# EAGLE design Extender (EAGLE 5.04)
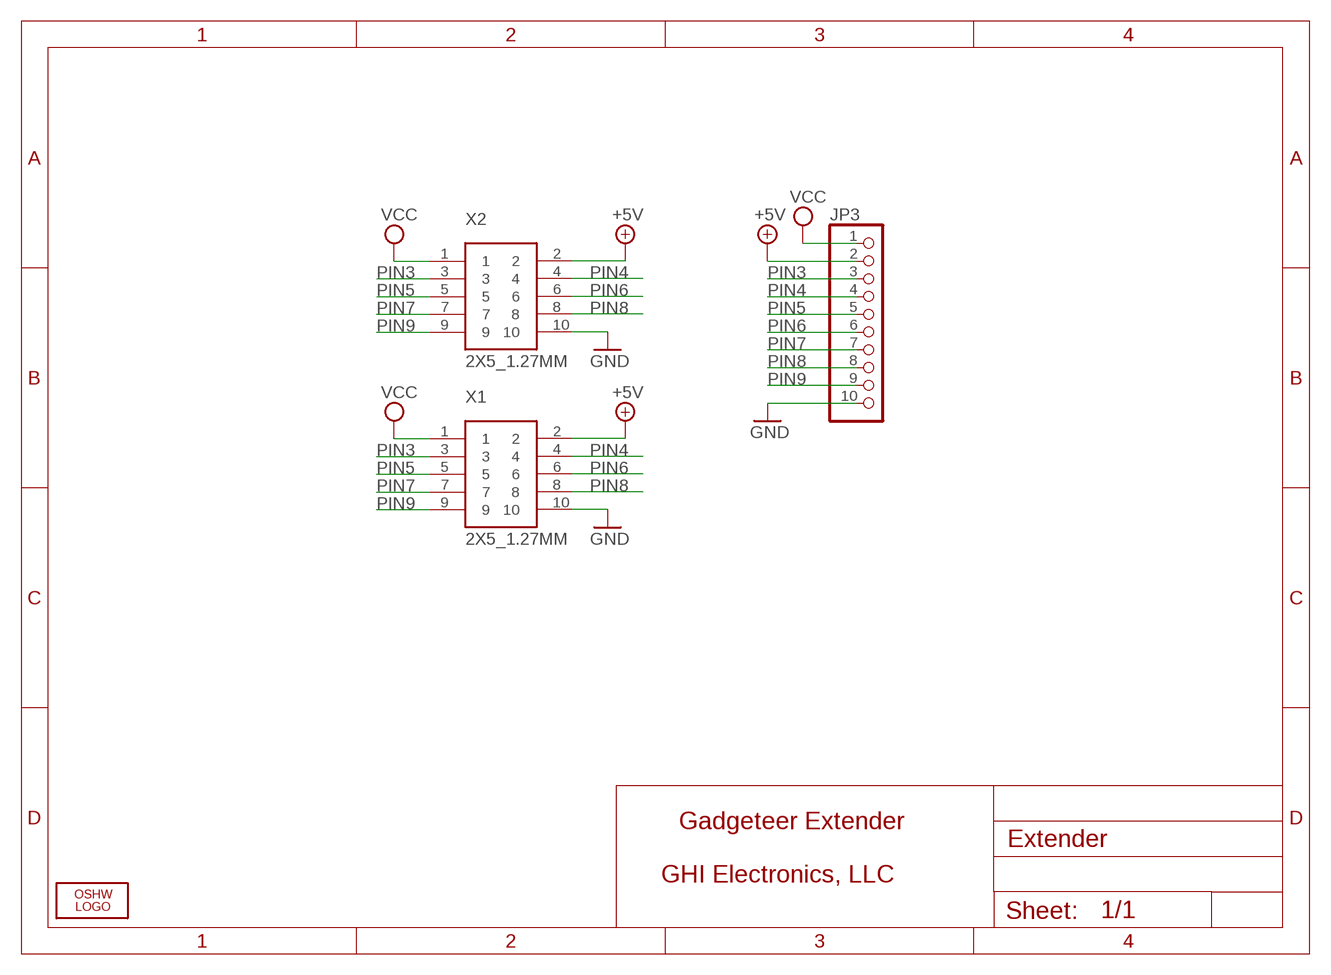
[diagram p0: schematic, sheet 1]

## Parts
JP3  PINHD-1X10  [1X10]
LOGO1  LOGO-OSHW-FILLX0200-NT  [OSHW_FILLX200_NOTEXT]
X1  2X5_1.27MM  [2X5_1.27MM]
X2  2X5_1.27MM  [2X5_1.27MM]

## Nets
+5V [power]: JP3.2 X1.2 X2.2
GND [power]: JP3.10 X1.10 X2.10
PIN3: JP3.3 X1.3 X2.3
PIN4: JP3.4 X1.4 X2.4
PIN5: JP3.5 X1.5 X2.5
PIN6: JP3.6 X1.6 X2.6
PIN7: JP3.7 X1.7 X2.7
PIN8: JP3.8 X1.8 X2.8
PIN9: JP3.9 X1.9 X2.9
VCC [power]: JP3.1 X1.1 X2.1

## Notes on the sheet
- Gadgeteer Extender
- GHI Electronics, LLC

## Library data of the parts
JP3 = pinhead:PINHD-1X10: PIN HEADER
LOGO1 = Logo:LOGO-OSHW-FILL
X1 X2 = GHI:2X5_1.27MM

## Net classes
0 default: width 0.254 mm, drill 0.381 mm, clearance 0.203 mm

## Board
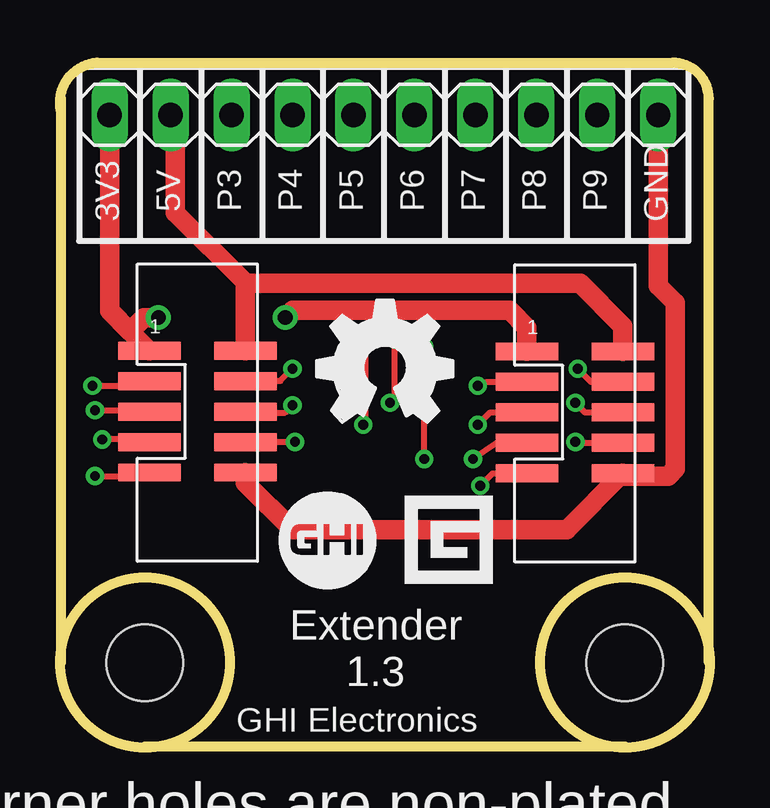
[diagram p1: board, top side]
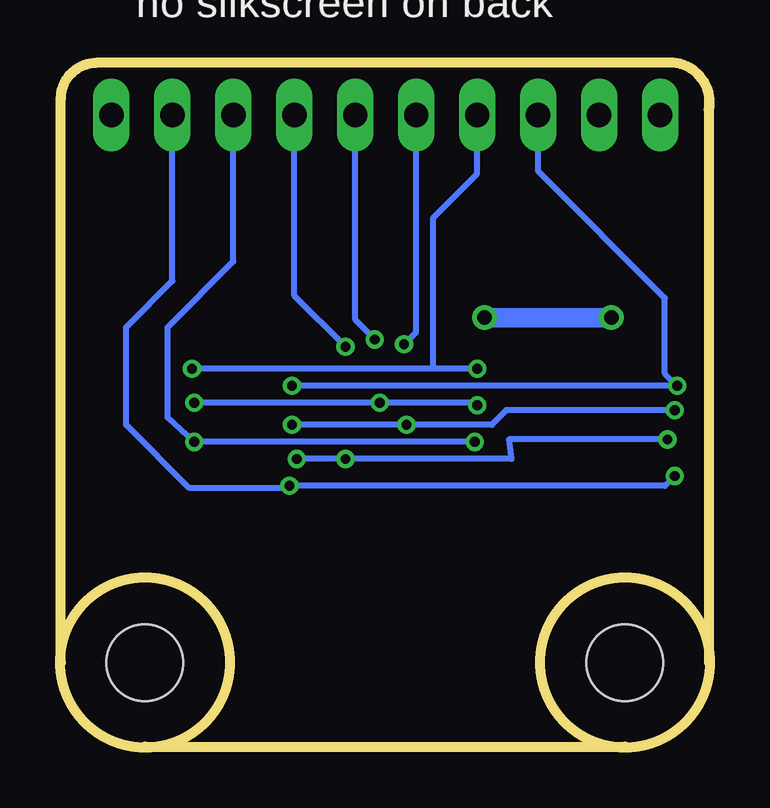
[diagram p2: board, bottom side, seen from below]

Size 27.07 x 28.54 mm. Coordinates in mm from the lower left corner, seen from the top.
Outline: 27.04,3.54 27.04,27.04 arc90 25.54,28.54 1.54,28.54 arc98 0.04,26.54
Outline: 0.04,27.04 0.04,26.54
Outline: 0.04,26.54 0.04,3.54
Outline: 23.54,0.04 3.54,0.04
Outline: circle at 23.54,3.54 radius 3.54
Outline: circle at 3.54,3.54 radius 3.54
Copper layers (1+16): Top 0.035mm / dielectric 1.5mm / Bottom 0.035mm
Design rules "default *": minimum track width 8mil, minimum drill 12mil, track to track 8mil, track to pad 8mil, pad to pad 8mil, via to via 8mil, smd to smd 8mil, copper to edge 15mil, drill to drill 8mil, minimum pad ring 10mil, minimum via ring 7mil, stop-mask expansion 4mil, vias tented up to drill 50mil, thermal gap 10mil
Holes 3.2 mm at 3.54,3.54 23.54,3.54

### Footprints (pad centres in the part's own frame; a part is rotated, then mirrored left to right if it is on the bottom)
1X10 = drill 1.016 long: 1 -11.43,0; 2 -8.89,0; 3 -6.35,0; 4 -3.81,0; 5 -1.27,0; 6 1.27,0; 7 3.81,0; 8 6.35,0; 9 8.89,0; 10 11.43,0
2X5_1.27MM = smd 2.6 x 0.74: 1 -2,2.58; 2 2,2.58; 3 -2,1.31; 4 2,1.31; 5 -2,0.04; 6 2,0.04; 7 -2,-1.23; 8 2,-1.23; 9 -2,-2.5; 10 2,-2.5

### Placement (x,y rotation side)
JP3  13.5,26.36 0 top
LOGO1  10.7,13.55 0 top
X1  5.73,13.95 0 top
X2  21.46,13.93 0 top

### Tracks (layer width: path | path; a pad name or v marks a point on that pad's centre or on a via)
+5V
  Top 0.813: X2.2 23.46,17.56 21.68,19.34 7.76,19.34 | 7.76,19.34 4.81,22.29 4.81,26.16 JP3.2 | X1.2 7.73,19.31 7.76,19.34
GND
  Top 0.813: X1.10 7.73,11.04 9.69,9.08 21.11,9.08 X2.10 23.57,11.31 25.33,11.31 25.64,11.62 25.64,18.53 24.93,19.24 JP3.10
PIN3  (via drill 0.41)
  Top 0.254: X2.3 17.78,15.24 v17.41,15.07 | v1.36,15.07 3.53,15.07 X1.3
  Bottom 0.254: v17.41,15.07 v1.36,15.07 1.86,15.58 1.86,18.73 7.15,24.01 JP3.3
PIN4  (via drill 0.41)
  Top 0.254: X2.4 22.12,15.24 v21.57,15.78 | v9.69,15.78 9.18,15.28 X1.4
  Bottom 0.254: v9.69,15.78 11.41,15.78 | 11.41,15.78 v21.57,15.78 | JP3.4 9.69,23.91 11.52,22.08 11.52,15.89 11.41,15.78
PIN5  (via drill 0.41)
  Top 0.254: X2.5 17.93,13.97 v17.41,13.45 | v1.46,14.06 3.66,14.06 X1.5 | v12.74,16.8 12.74,13.55 v12.63,13.45
  Bottom 0.254: v17.41,13.45 v12.63,13.45 9.08,13.45 8.47,14.06 v1.46,14.06 | JP3.5 12.23,17.31 v12.74,16.8
PIN6  (via drill 0.41)
  Top 0.254: X2.6 21.87,13.97 v21.47,14.36 | v9.69,14.26 9.38,13.95 7.77,13.95 X1.6 | v13.95,17 13.95,14.56 v13.75,14.36
  Bottom 0.254: v21.47,14.36 v13.75,14.36 9.79,14.36 v9.69,14.26 | JP3.6 14.77,17.82 v13.95,17
PIN7  (via drill 0.41)
  Top 0.254: X2.7 18.18,12.7 v17.21,12.02 | v1.76,12.84 3.61,12.84 X1.7 | v15.17,12.02 v15.17,16.7
  Bottom 0.254: v17.21,12.02 v15.17,12.02 8.27,12.02 8.37,12.84 v1.76,12.84 | JP3.7 17.31,18.83 v15.17,16.7
PIN8  (via drill 0.41)
  Top 0.254: X2.8 21.61,12.7 v21.47,12.74 | v9.79,12.74 X1.8
  Bottom 0.254: v9.79,12.74 v21.47,12.74 22.59,13.75 22.59,17.51 19.85,20.25 JP3.8
PIN9  (via drill 0.41)
  Top 0.254: X2.9 18.03,11.43 v17.51,10.91 | v1.46,11.31 3.58,11.31 X1.9
  Bottom 0.254: v1.46,11.31 1.86,10.91 v17.51,10.91 17.92,10.81 21.68,10.81 24.32,13.45 24.32,17.51 22.39,19.44 JP3.9
VCC  (via drill 0.61)
  Top 0.813: JP3.1 2.07,18.19 2.92,17.34 | X1.1 2.92,17.34 | X2.1 19.46,17.5 18.73,18.22 9.69,18.22 v9.38,17.92 | v4.1,17.92 3.49,17.92 2.92,17.34
  Bottom 0.813: v4.1,17.92 v9.38,17.92

### Text on the board
tPlace: 3V3 | 5V | P3 | P4 | P5 | P6 | P7 | P8 | P9 | GND | Extender | 1.3 | GHI Electronics | Corner holes are non-plated | black PCB with white text | do not add manufacturing codes
bPlace: no silkscreen on back